# EAGLE schematic schematic (EAGLE 9.1.2)
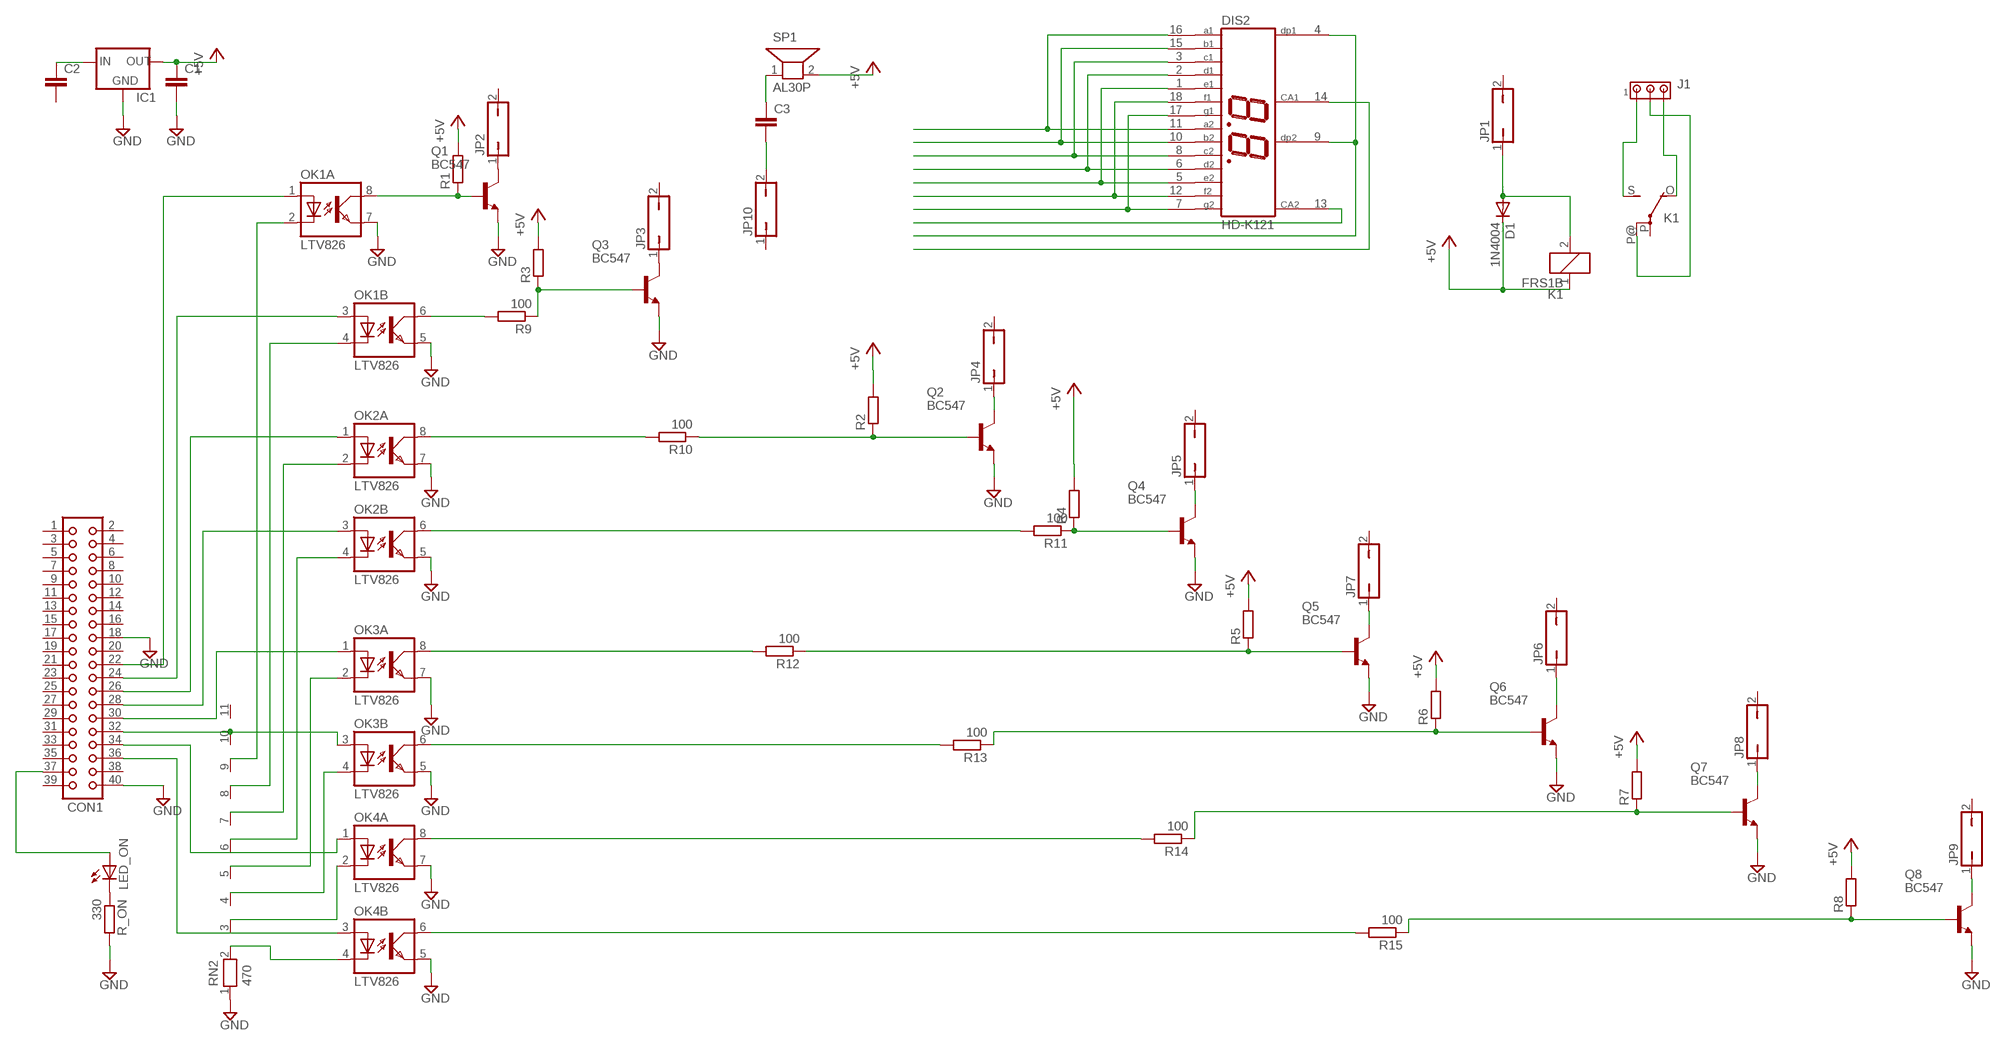
[diagram p0: schematic, sheet 1]

## Parts
C1  C5/2.5  [C5B2.5]
C2  C-EU075-063X106  [C075-063X106]
C3  C-EU075-063X106  [C075-063X106]
CON1  CON40  [CON40]
D1  1N4004  [DO41-10]
DIS2  HD-K121  [HDSP-R]
IC1  78MXXS  [78MXXS]
J1  MTA03-100  [10X03MTA]
JP1  JP1Q  [JP1]
JP2  JP1Q  [JP1]
JP3  JP1Q  [JP1]
JP4  JP1Q  [JP1]
JP5  JP1Q  [JP1]
JP6  JP1Q  [JP1]
JP7  JP1Q  [JP1]
JP8  JP1Q  [JP1]
JP9  JP1Q  [JP1]
JP10  JP1Q  [JP1]
K1  FRS1B  [FRS1B]
LED_ON  LED3MM  [LED3MM]
OK1  LTV826  [DIL08]
OK2  LTV826  [DIL08]
OK3  LTV826  [DIL08]
OK4  LTV826  [DIL08]
Q1  BC547  [TO92]
Q2  BC547  [TO92]
Q3  BC547  [TO92]
Q4  BC547  [TO92]
Q5  BC547  [TO92]
Q6  BC547  [TO92]
Q7  BC547  [TO92]
Q8  BC547  [TO92]
R1  R-EU_R3225  [R3225]
R2  R-EU_R3225  [R3225]
R3  R-EU_R3225  [R3225]
R4  R-EU_R3225  [R3225]
R5  R-EU_R3225  [R3225]
R6  R-EU_R3225  [R3225]
R7  R-EU_R3225  [R3225]
R8  R-EU_R3225  [R3225]
R9  100  R-EU_R3225  [R3225]
R10  100  R-EU_R3225  [R3225]
R11  100  R-EU_R3225  [R3225]
R12  100  R-EU_R3225  [R3225]
R13  100  R-EU_R3225  [R3225]
R14  100  R-EU_R3225  [R3225]
R15  100  R-EU_R3225  [R3225]
R_ON  330  R-EU_R3225  [R3225]
RN2  470  RN10  [RN-11]
SP1  AL30P  [AL30P]

## Nets
+5V: C1.1 D1.C IC1.OUT K1.1 R1.2 R3.2 R5.2 R6.2 R7.2 R8.2 SP1.2
GND: C1.2 CON1.18 CON1.40 IC1.GND OK1.5(B:EMIT) OK1.7(A:EMIT) OK2.5(B:EMIT) OK2.7(A:EMIT) OK3.5(B:EMIT) OK3.7(A:EMIT) OK4.5(B:EMIT) OK4.7(A:EMIT) Q1.1(E) Q2.1(E) Q3.1(E) Q4.1(E) Q5.1(E) Q6.1(E) Q7.1(E) Q8.1(E) R_ON.2 RN2.1
N$1: OK4.4(B:C) RN2.2
N$2: OK4.2(A:C) RN2.3
N$3: OK3.4(B:C) RN2.4
N$4: OK3.2(A:C) RN2.5
N$5: OK2.4(B:C) RN2.6
N$6: OK2.2(A:C) RN2.7
N$7: OK1.4(B:C) RN2.8
N$8: OK1.2(A:C) RN2.9
N$9: Q2.2(B) R2.1 R10.1
N$10: Q3.2(B) R3.1 R9.1
N$11: OK1.8(A:COL) Q1.2(B) R1.1
N$12: JP2.1 Q1.3(C)
N$13: R2.2
N$14: D1.A JP1.1 K1.2
N$15: Q4.2(B) R4.1 R11.1
N$16: R4.2
N$17: Q5.2(B) R5.1 R12.1
N$18: JP3.1 Q3.3(C)
N$19: Q6.2(B) R6.1 R13.1
N$20: JP4.1 Q2.3(C)
N$21: Q7.2(B) R7.1 R14.1
N$22: JP5.1 Q4.3(C)
N$23: Q8.2(B) R8.1 R15.1
N$24: JP6.1 Q6.3(C)
N$25: J1.2 K1.P@(2:P)
N$26: J1.1 K1.S(2:S)
N$27: J1.3 K1.O(2:O)
N$28: OK1.6(B:COL) R9.2
N$29: OK2.8(A:COL) R10.2
N$30: OK2.6(B:COL) R11.2
N$31: OK3.8(A:COL) R12.2
N$32: OK3.6(B:COL) R13.2
N$33: OK4.8(A:COL) R14.2
N$34: OK4.6(B:COL) R15.2
N$35: DIS2.11(A2) DIS2.16(A1)
N$36: DIS2.10(B2) DIS2.15(B1)
N$37: DIS2.3(C1) DIS2.8(C2)
N$38: DIS2.2(D1) DIS2.6(D2)
N$39: DIS2.1(E1) DIS2.5(E2)
N$40: DIS2.12(F2) DIS2.18(F1)
N$41: DIS2.7(G2) DIS2.17(G1)
N$42: CON1.36 OK4.3(B:A)
N$43: CON1.34 OK4.1(A:A)
N$44: CON1.32 OK3.3(B:A) RN2.10
N$45: CON1.30 OK3.1(A:A)
N$46: CON1.28 OK2.3(B:A)
N$47: CON1.26 OK2.1(A:A)
N$48: CON1.22 OK1.1(A:A)
N$49: CON1.24 OK1.3(B:A)
N$50: CON1.37 LED_ON.A
N$51: LED_ON.K(C) R_ON.1
N$52: JP7.1 Q5.3(C)
N$53: JP9.1 Q8.3(C)
N$54: JP8.1 Q7.3(C)
N$55: C2.1 IC1.IN
N$56: C3.2 JP10.2
N$57: C3.1 SP1.1
N$58: DIS2.13(CA2)
N$59: DIS2.4(DP1) DIS2.9(DP2)
N$60: DIS2.14(CA1)
Unconnected: C2.2 CON1.1 CON1.2 CON1.3 CON1.4 CON1.5 CON1.6 CON1.7 CON1.8 CON1.9 CON1.10 CON1.11 CON1.12 CON1.13 CON1.14 CON1.15 CON1.16 CON1.17 CON1.19 CON1.20 CON1.21 CON1.23 CON1.25 CON1.27 CON1.29 CON1.31 CON1.33 CON1.35 CON1.38 CON1.39 JP1.2 JP2.2 JP3.2 JP4.2 JP5.2 JP6.2 JP7.2 JP8.2 JP9.2 JP10.1 K1.P(2:P) RN2.11

## Library data of the parts
C1 = capacitor-wima:C: CAPACITOR naming: grid - package width
C2 C3 = rcl:C-EU: CAPACITOR, European symbol; SPICEPREFIX: C
CON1 = con-harting:CON40: CONNECTOR; OC_FARNELL: unknown; OC_NEWARK: unknown
D1 = diode:1N4004: DIODE general purpose rectifier, 1 A
DIS2 = display-hp:HD-K121: LED DISPLAY 2 x 1 character 7 segment, decimal points right; OC_FARNELL: unknown; OC_NEWARK: unknown
IC1 = v-reg:78MXXS: VOLTAGE REGULATOR
J1 = con-amp:MTA03-100: AMP connector
JP1-JP10 = jumper:JP1Q: JUMPER
K1 = relay:FRS1B: RELAY 1 x switch, same as V23101-D6-A201, Siemens; OC_FARNELL: unknown; OC_NEWARK: unknown
LED_ON = led:LED: LED OSRAM: - CHIPLED LG R971, LG N971, LY N971, LG Q971, LY Q971, LO R971, LY R971 LH N974, LH R974 LS Q976, LO Q976, LY Q976 LO Q996 - Hyper CHIPLED LW Q18S LB Q993, LB Q99A, LB R99A - SideLED LS A670, LO A670, LY A670, LG A670, LP A670 LB A673, LV A673, LT A673, LW A673 LH A674 LY A675 LS A676, LA A676, LO A676, LY A676, LW A676 LS A679, LY A679, LG A679 - Hyper Micro SIDELED® LS Y876, LA Y876, LO Y876, LY Y876 LT Y87S - SmartLED LW L88C, LW L88S LB L89C, LB L89S, LG L890 LS L89K, LO L89K, LY L89K LS L896, LA L896, LO L896, LY L896 - TOPLED LS T670, LO T670, LY T670, LG T670, LP T670 LSG T670, LSP T670, LSY T670, LOP T670, LYG T670 LG T671, LOG T671, LSG T671 LB T673, LV T673, LT T673, LW T673 LH T674 LS T676, LA T676, LO T676, LY T676, LB T676, LH T676, LSB T676, LW T676 LB T67C, LV T67C, LT T67C, LS T67K, LO T67K, LY T67K, LW E67C LS E67B, LA E67B, LO E67B, LY E67B, LB E67C, LV E67C, LT E67C LW T67C LS T679, LY T679, LG T679 LS T770, LO T770, LY T770, LG T770, LP T770 LB T773, LV T773, LT T773, LW T773 LH T774 LS E675, LA E675, LY E675, LS T675 LS T776, LA T776, LO T776, LY T776, LB T776 LHGB T686 LT T68C, LB T68C - Hyper Mini TOPLED® LB M676 - Mini TOPLED Santana® LG M470 LS M47K, LO M47K, LY M47K Source: http://www.osram.convergy.de LUXEON: - LUMILED® LXK2-PW12-R00, LXK2-PW12-S00, LXK2-PW14-U00, LXK2-PW14-V00 LXK2-PM12-R00, LXK2-PM12-S00, LXK2-PM14-U00 LXK2-PE12-Q00, LXK2-PE12-R00, LXK2-PE12-S00, LXK2-PE14-T00, LXK2-PE14-U00 LXK2-PB12-K00, LXK2-PB12-L00, LXK2-PB12-M00, LXK2-PB14-N00, LXK2-PB14-P00, LXK2-PB14-Q00 LXK2-PR12-L00, LXK2-PR12-M00, LXK2-PR14-Q00, LXK2-PR14-R00 LXK2-PD12-Q00, LXK2-PD12-R00, LXK2-PD12-S00 LXK2-PH12-R00, LXK2-PH12-S00 LXK2-PL12-P00, LXK2-PL12-Q00, LXK2-PL12-R00 Source: www.luxeon.com KINGBRIGHT: KA-3528ASYC Source: www.kingbright.com
OK1-OK4 = optocoupler:LTV826: OPTO COUPLER Source: LITEON, LTV816.pdf; OC_FARNELL: unknown; OC_NEWARK: unknown
Q1-Q8 = transistor-npn:BC547*: NPN Transistor
R1-R15 R_ON = rcl:R-EU_: RESISTOR, European symbol; SPICEPREFIX: R
RN2 = resistor-net:RN10: RESISTOR NETWORK; OC_FARNELL: unknown; OC_NEWARK: unknown
SP1 = buzzer:AL30P: SPEAKER Source: Buerklin; OC_FARNELL: unknown; OC_NEWARK: unknown